# Altium project bogo_board.PrjPcb (part 1 of 4)
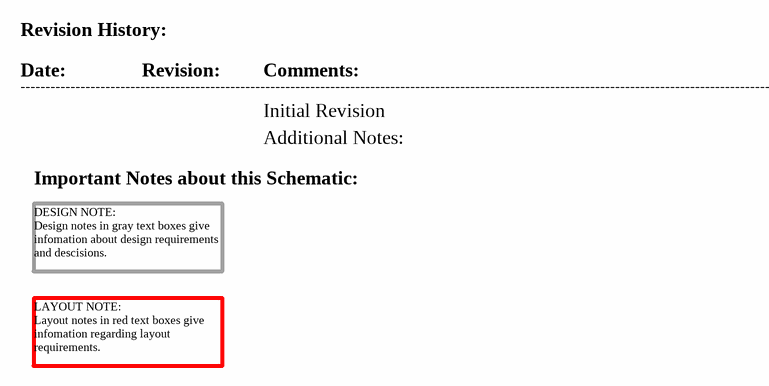
[diagram p0: 01-Revision_History_and_Contents.SchDoc]
10 sheets, 195 parts. Net scope: global (net labels, ports and power ports of the same name join across sheets).
Board file: bogo_board.PcbDoc
Sheets:
  01-Revision_History_and_Contents.SchDoc
  05_Buzz_Pump_LED_Temp_ICs.SchDoc
  04_Brushed_Motor_ICs.SchDoc
  03_Power_ICs.SchDoc
  10_Mechanical.SchDoc
  02_Connectors.SchDoc
  07_MCU.SchDoc
  08_Programming_Reset.SchDoc
  06_Servo_Motor_ICs.SchDoc
  09_USB_Bridge.SchDoc

## Sheet 01-Revision_History_and_Contents.SchDoc: Revision History and Table of Contents
size A; Revision: A; SheetNumber: 1; SheetTotal: 10; ECE315_Project_Name: ECE453 F23 Base Project

### Notes on the sheet
- Revision History:
- Date:
- ----------------------------------------------------------------------------------------------------------------------------------------------------------------------
- Revision:
- Comments:
- Initial Revision
- Important Notes about this Schematic:
- Additional Notes:
- DESIGN NOTE:
  Design notes in gray text boxes give infomation about design requirements and descisions.
- LAYOUT NOTE:
  Layout notes in red text boxes give infomation regarding layout requirements.
- Title:
- Size:
- A
- Project
- Rev:
- Sheet:
- of
- College of Engineering
- 1415 Engineering Drive
- Madison, WI 53706

## Sheet 05_Buzz_Pump_LED_Temp_ICs.SchDoc: Buzz Pump LED Temp ICs
size A; Revision: A; SheetNumber: 5; SheetTotal: 10; ECE315_Project_Name: ECE453 F23 Base Project
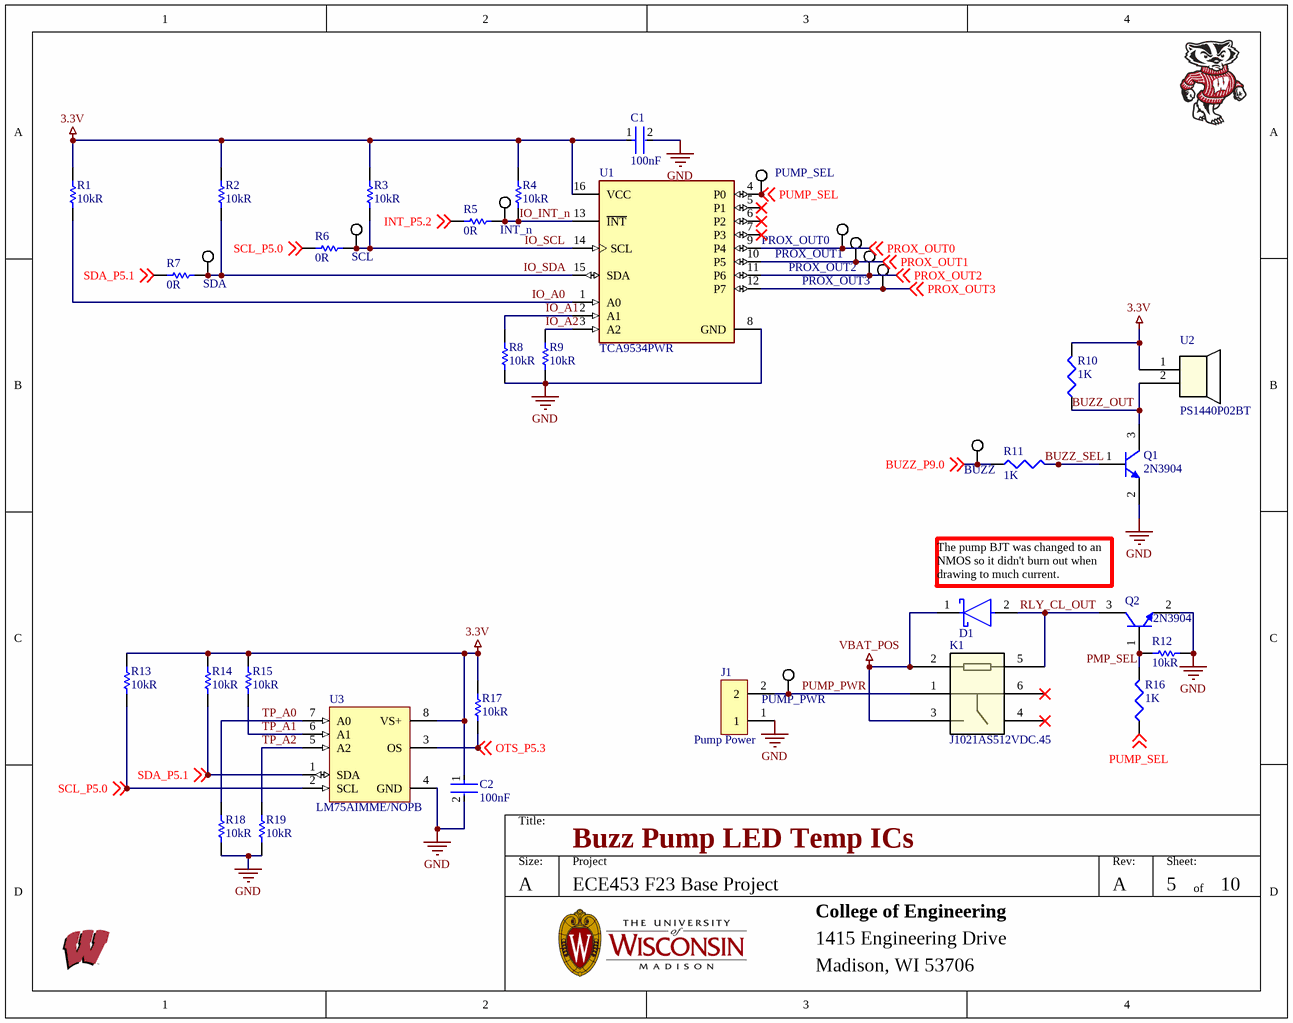
[diagram p1: 05_Buzz_Pump_LED_Temp_ICs.SchDoc]

### Parts
BUZZ  5019  [KSTN-5019_V]  (value not drawn)
C1  value 100nF  [FP-C0805C-DN-MFG]  (hidden comment: C0805C104K5RACTU)
C2  value 100nF  [FP-C0805C-DN-MFG]  (hidden comment: C0805C104K5RACTU)
D1  SM5817PL-TP  [On_Semiconductor_425-04_IPC_A]  (value not drawn)
INT_n  5019  [KSTN-5019_V]  (value not drawn)
J1  Pump Power  [PHOENIX2X0.2]
K1  J1021AS512VDC.45  [RELAY6_J102_CRS]
PROX_OUT0  5019  [KSTN-5019_V]  (value not drawn)
PROX_OUT1  5019  [KSTN-5019_V]  (value not drawn)
PROX_OUT2  5019  [KSTN-5019_V]  (value not drawn)
PROX_OUT3  5019  [KSTN-5019_V]  (value not drawn)
PUMP_PWR  5019  [KSTN-5019_V]  (value not drawn)
PUMP_SEL  5019  [KSTN-5019_V]  (value not drawn)
Q1  2N3904  [SOT-23_M]
Q2  2N3904  [SOT-23_M]
R1  Resistance: 10kR  [RESC2013X60X35NL10T20]  (hidden comment: RC0805FR-0710KL)
R2  Resistance: 10kR  [RESC2013X60X35NL10T20]  (hidden comment: RC0805FR-0710KL)
R3  Resistance: 10kR  [RESC2013X60X35NL10T20]  (hidden comment: RC0805FR-0710KL)
R4  Resistance: 10kR  [RESC2013X60X35NL10T20]  (hidden comment: RC0805FR-0710KL)
R5  value 0R  [RESC2013X70X40NL20T20]  (hidden comment: ERJ-6GEY0R00V)
R6  value 0R  [RESC2013X70X40NL20T20]  (hidden comment: ERJ-6GEY0R00V)
R7  value 0R  [RESC2013X70X40NL20T20]  (hidden comment: ERJ-6GEY0R00V)
R8  Resistance: 10kR  [RESC2013X60X35NL10T20]  (hidden comment: RC0805FR-0710KL)
R9  Resistance: 10kR  [RESC2013X60X35NL10T20]  (hidden comment: RC0805FR-0710KL)
R10  value 1K  [RES_0805]  (hidden comment: 10K)
R11  value 1K  [RES_0805]  (hidden comment: 10K)
R12  Resistance: 10kR  [RESC2013X60X35NL10T20]  (hidden comment: RC0805FR-0710KL)
R13  Resistance: 10kR  [RESC2013X60X35NL10T20]  (hidden comment: RC0805FR-0710KL)
R14  Resistance: 10kR  [RESC2013X60X35NL10T20]  (hidden comment: RC0805FR-0710KL)
R15  Resistance: 10kR  [RESC2013X60X35NL10T20]  (hidden comment: RC0805FR-0710KL)
R16  value 1K  [RES_0805]  (hidden comment: 10K)
R17  Resistance: 10kR  [RESC2013X60X35NL10T20]  (hidden comment: RC0805FR-0710KL)
R18  Resistance: 10kR  [RESC2013X60X35NL10T20]  (hidden comment: RC0805FR-0710KL)
R19  Resistance: 10kR  [RESC2013X60X35NL10T20]  (hidden comment: RC0805FR-0710KL)
SCL  5019  [KSTN-5019_V]  (value not drawn)
SDA  5019  [KSTN-5019_V]  (value not drawn)
U1  TCA9534PWR  [FP-PW0016A-IPC_C]
U2  PS1440P02BT  [PS1440P02BT_TDK]
U3  LM75AIMME/NOPB  [DGK0008A_L]

### Nets
3.3V: C1.1 C2.1 R1.2 R2.2 R3.2 R4.2 R10.2 R13.2 R14.2 R15.2 R17.2 U1.16(VCC) U2.1 U3.8(VS+)
GND: C1.2 C2.2 J1.1 Q1.2(E) Q2.2(E) R8.1 R9.1 R12.1 R18.1 R19.1 U1.8(GND) U3.4(GND)
VBAT_POS: D1.1(C) K1.2 K1.3
BUZZ_OUT: Q1.3(C) R10.1 U2.2
BUZZ_P9.0: BUZZ.1 R11.1 ; off-sheet BUZZ_P9.0
BUZZ_SEL: Q1.1(B) R11.2
INT_P5.2: R5.1 ; off-sheet INT_P5.2
IO_A0: R1.1 U1.1(A0)
IO_A1: R8.2 U1.2(A1)
IO_A2: R9.2 U1.3(A2)
IO_INT_n: INT_n.1 R4.1 R5.2 U1.13(~{INT})
IO_SCL: R3.1 R6.2 SCL.1 U1.14(SCL)
IO_SDA: R2.1 R7.2 SDA.1 U1.15(SDA)
OTS_P5.3: R17.1 U3.3(OS) ; off-sheet OTS_P5.3
PMP_SEL: Q2.1(B) R12.2 R16.2
PROX_OUT0: PROX_OUT0.1 U1.9(P4) ; off-sheet PROX_OUT0
PROX_OUT1: PROX_OUT1.1 U1.10(P5) ; off-sheet PROX_OUT1
PROX_OUT2: PROX_OUT2.1 U1.11(P6) ; off-sheet PROX_OUT2
PROX_OUT3: PROX_OUT3.1 U1.12(P7) ; off-sheet PROX_OUT3
PUMP_PWR: J1.2 K1.1 PUMP_PWR.1
PUMP_SEL: PUMP_SEL.1 R16.1 U1.4(P0) ; off-sheet PUMP_SEL
RLY_CL_OUT: D1.2(A) K1.5 Q2.3(C)
SCL_P5.0: R6.1 R13.1 U3.2(SCL) ; off-sheet SCL_P5.0
SDA_P5.1: R7.1 R14.1 U3.1(SDA) ; off-sheet SDA_P5.1
TP_A0: R18.2 U3.7(A0)
TP_A1: R15.1 U3.6(A1)
TP_A2: R19.2 U3.5(A2)

Not connected (* = marked no-connect by the designer): K1 4* 6*; U1 5(P1)* 6(P2)* 7(P3)*

### Notes on the sheet
- The pump BJT was changed to an NMOS so it didn't burn out when drawing to much current.
- Title:
- Size:
- A
- Project
- Rev:
- Sheet:
- of
- College of Engineering
- 1415 Engineering Drive
- Madison, WI 53706

### Library data of the parts
BUZZ INT_n PROX_OUT0-PROX_OUT3 PUMP_PWR PUMP_SEL SCL SDA = CMP-1672-00008-1: Test Point, 1 Position SMD, RoHS, Tape and Reel; Manufacturer: Keystone Electronics; Plating: Silver; Body Material: Bronze; Supplier: Newark; Supplier Part Number: 59Y8500; Manufacturer Part Number: 5019; RoHS: Yes; Category: Connectors; Stock: 11269; Pricing: 1=0.411, 10=0.389, 25=0.285, 50=0.279, 100=0.273, 250=0.246 (USD); Mounting Technology: Surface Mount,PCB; Pins: 1; Contact Plating: Silver; Contact Material: Bronze; Material: Bronze; Packaging: Tape and Reel; Package Quantity: 1; Termination: SMD/SMT; Series: 5019; Height: 0.09inch; Reach SVHC Compliant: No; RoHS Compliant: Yes; Lead Free: Lead Free; ComponentLink1URL: https://datasheet.ciiva.com/14848/m60-2p61-14848437.pdf?src-supplier=Digi-Key; ComponentLink1Description: https://datasheet.ciiva.com/14848/m60-2p61-14848437.pdf?src-supplier=Digi-Key; ComponentLink2URL: https://datasheet.ciiva.com/14848/m60-2p61-14848438.pdf?src-supplier=Digi-Key; ComponentLink2Description: https://datasheet.ciiva.com/14848/m60-2p61-14848438.pdf?src-supplier=Digi-Key; ComponentLink3URL: https://datasheet.ciiva.com/14848/m60-2p61-14848439.pdf?src-supplier=Digi-Key; ComponentLink3Description: https://datasheet.ciiva.com/14848/m60-2p61-14848439.pdf?src-supplier=Digi-Key; ComponentLink4URL: https://datasheet.ciiva.com/16318/m60-2p61-16318395.pdf?src-supplier=Future+Electronics; ComponentLink4Description: https://datasheet.ciiva.com/16318/m60-2p61-16318395.pdf?src-supplier=Future+Electronics; ComponentLink5URL: https://datasheet.ciiva.com/16885/70182998-16885945.pdf?src-supplier=Allied+Electronics; ComponentLink5Description: https://datasheet.ciiva.com/16885/70182998-16885945.pdf?src-supplier=Allied+Electronics
C1 C2 = CMP-2007-00279-2: CAP CER 0.1UF 50V X7R 0805; Manufacturer: KEMET; Tolerance: 10%; Voltage: 500V; ComponentLink2Description: Datasheet; ComponentLink2URL: https://content.kemet.com/datasheets/KEM_C1003_C0G_SMD.pdf; Supplier: Newark; Supplier Part Number: 19C6015; Manufacturer Part Number: C0805C104K5RACTU; RoHS: Yes; Category: Ceramic Capacitors; Stock: 3382390; Pricing: 1=0.024, 25=0.024, 50=0.024, 100=0.024, 250=0.024, 500=0.024, 1000=0.024 (USD); Mounting Technology: Surface Mount,PCB; Case/Package: 0805; Pins: 2; Case Code (Imperial): 0805; Case Code (Metric): 2012; Min Operating Temperature: -55°C; Max Operating Temperature: 125°C; Package Quantity: 4000; Voltage Rating: 50V; Packaging: Tape and Reel; Voltage Rating (DC): 50V; Dielectric: X7R; Termination: SMD/SMT; Series: SMD Comm X7R; Construction: Flat; Length: 2mm; Width: 1.2mm; Height: 0.9mm; Lead Pitch: 0.75mm; Depth: 1.25mm; Radiation Hardening: No; RoHS Compliant: Yes; Reach SVHC Compliant: No; ComponentLink1URL: https://datasheet.ciiva.com/32431/slceramic-chip-condensers-e-32431755.pdf?src-supplier=Distrelec; ComponentLink1Description: https://datasheet.ciiva.com/32431/slceramic-chip-condensers-e-32431755.pdf?src-supplier=Distrelec; ComponentLink3URL: https://datasheet.ciiva.com/28682/1851736-28682232.pdf?src-supplier=Element14; ComponentLink3Description: https://datasheet.ciiva.com/28682/1851736-28682232.pdf?src-supplier=Element14
D1 = SM5817PL-TP: DIODE SCHOTTKY 20V 1A SOD123FL; Forward Voltage: 450mV; Max Surge Current: 30A; Element Configuration: Single; Manufacturer 2: MCC; Manufacturer Part Number 2: SM5817PL-TP; RoHS: Yes; Category: Rectifier Diodes; Stock 2: 178040; Pricing 2: 1=0.46000, 10=0.31900, 100=0.16110, 500=0.13144, 1000=0.09752 (USD); Mount: Surface Mount; Number of Pins: 2; Min Operating Temperature: -65°C; Max Operating Temperature: 125°C; Packaging: Tape and Reel; Package Quantity: 1; Average Rectified Current: 1A; Peak Non-Repetitive Surge Current: 30A; Max Reverse Voltage (DC): 20V; Reverse Voltage: 20V; Radiation Hardening: No; RoHS Compliant: Yes; ComponentLink1URL: https://datasheet.ciiva.com/15200/getdatasheetpartid-487494-15200581.pdf?src-supplier=Verical; ComponentLink1Description: https://datasheet.ciiva.com/15200/getdatasheetpartid-487494-15200581.pdf?src-supplier=Verical; ComponentLink2URL: https://datasheet.ciiva.com/912/sm5817pl-sm5819plsod-123fl-912827.pdf?src-supplier=Digi-Key; ComponentLink2Description: https://datasheet.ciiva.com/912/sm5817pl-sm5819plsod-123fl-912827.pdf?src-supplier=Digi-Key; Supplier 1: Digi-Key; Supplier Part Number 1: SM5817PL-TPMSCT-ND
J1 = 2-Pin: 2~24 Poles, Screw Type, Horizontal, 5.08 Pitch, 26~14 (AWG), Terminal Block Connector; Manufacturer: CUI Devices; Manufacturer Part Number: TB006-508-02BE; ComponentLink1URL: https://datasheet.ciiva.com/709/eng-cd-640456-w1-709680.pdf?src-supplier=Digi-Key; ComponentLink1Description: https://datasheet.ciiva.com/709/eng-cd-640456-w1-709680.pdf?src-supplier=Digi-Key; ComponentLink2URL: https://datasheet.ciiva.com/3118/eng-ds-82056-mta-0608-3118497.pdf?src-supplier=Avnet; ComponentLink2Description: https://datasheet.ciiva.com/3118/eng-ds-82056-mta-0608-3118497.pdf?src-supplier=Avnet; ComponentLink3URL: https://datasheet.ciiva.com/16401/eng-ds-82056-mta-0608-16401289.pdf?src-supplier=Future+Electronics; ComponentLink3Description: https://datasheet.ciiva.com/16401/eng-ds-82056-mta-0608-16401289.pdf?src-supplier=Future+Electronics; ComponentLink4URL: https://datasheet.ciiva.com/25617/0900766b80027008-25617244.pdf?src-supplier=RSComponents; ComponentLink4Description: https://datasheet.ciiva.com/25617/0900766b80027008-25617244.pdf?src-supplier=RSComponents; ComponentLink5URL: https://datasheet.ciiva.com/14156/04384301-14156820.pdf?src-supplier=Distrelec; ComponentLink5Description: https://datasheet.ciiva.com/14156/04384301-14156820.pdf?src-supplier=Distrelec; ComponentLink6URL: https://datasheet.ciiva.com/11746/0900766b80eb7fdd-11746365.pdf?src-supplier=RSComponents; ComponentLink6Description: https://datasheet.ciiva.com/11746/0900766b80eb7fdd-11746365.pdf?src-supplier=RSComponents; ComponentLink7URL: https://datasheet.ciiva.com/7128/1866390-7128742.pdf?src-supplier=Newark; ComponentLink7Description: https://datasheet.ciiva.com/7128/1866390-7128742.pdf?src-supplier=Newark; ComponentLink8URL: https://datasheet.ciiva.com/16505/eng-ds-82056-mta-0608-16505419.pdf?src-supplier=Avnet+Asia; ComponentLink8Description: https://datasheet.ciiva.com/16505/eng-ds-82056-mta-0608-16505419.pdf?src-supplier=Avnet+Asia; Supplier: Digi-Key; RoHS: Yes; Category: Terminal Blocks; Stock 1: 50889; Pricing 1: 1=0.86, 10=0.472, 25=0.3524, 50=0.3142, 100=0.308, 250=0.27108, 500=0.24644, 1000=0.2218, 5000=0.16635 (USD); Supplier Part Number: 102-6191-ND
K1 = J1021AS512VDC.45: No Description Available; Mfr_Name: CIT Relay & Switch; Type: DEV; Copyright: Copyright (C) 2023 Ultra Librarian. All rights reserved.; Manufacturer_Part_Number: J1021AS512VDC.45; RefDes: RefDes
Q1 Q2 = 2N3904: NPN General Purpose Amplifier; Manufacturer Part Number: MMBT3904-7-F; Manufacturer: Diodes Incorporated; Frequency - Transition: 300MHz; Power - Max: 300mW; DC Current Gain (hFE) (Min) @ Ic, Vce: 100 @ 10mA, 1V; Current - Collector Cutoff (Max): 50nA (ICBO); Vce Saturation (Max) @ Ib, Ic: 300mV @ 5mA, 50mA; Voltage - Collector Emitter Breakdown (Max): 40V; Current - Collector (Ic) (Max): 200mA; Supplier Device Package: SOT-23-3; Mounting Type: Surface Mount; Transistor Type: NPN; Packaging: Cut Tape (CT); RoHS: RoHS Compliant; Package / Case: TO-236-3, SC-59, SOT-23-3; Supplier Part Number: MMBT3904-FDICT-ND; Supplier: Digi-Key; Category: Discrete Semiconductor Products; Value: 2N3904
R1-R4 R8 R9 R12-R15 R17-R19 = CMP-1659-00013-4: Chip Resistor, 10 KOhm, +/- 1%, 0.125 W, -55 to 155 degC, 0805 (2012 Metric), RoHS, Tape and Reel; Manufacturer: Yageo; Voltage Rating: 150 V; Temperature Coefficient: 100ppm/°C; Power Rating: 125mW; Value: 10kR; Mount: Surface Mount; ComponentLink1Description: Manufacturer URL; ComponentLink2URL: http://www.yageo.com/documents/recent/PYu-RC_Group_51_RoHS_L_04.pdf; Pins: 2; Length: 2 mm; Min Operating Temperature: -55 degC; Height: 0.5 mm; Mounting Technology: Surface Mount; RoHSCompliant: true; REACH SVHC: No SVHC; ComponentLink1URL: http://www.yageo.com/; Max Operating Temperature: 155 degC; PackageReference: 0805; DatasheetVersion: Rev. 4, 02/2016; Package Quantity: 5000; Packaging: Tape and Reel; ComponentLink2Description: Datasheet; PackageDescription: 2-Pin Surface Mounted Device, Body 2 x 1.25 mm; Supplier 1: Digi-Key; Supplier Part Number 1: 311-10.0KCRCT-ND; Manufacturer 1: Yageo; Manufacturer Part Number 1: RC0805FR-0710KL; RoHS: Yes; Category: Chip SMD Resistors; Stock 1: 5682818; Pricing 1: 1=0.10000, 10=0.03800, 100=0.01560, 1000=0.00702, 2500=0.00610 (USD); Case/Package: 0805; Case Code (Imperial): 0805; Case Code (Metric): 2012; Size Code: 0805; Tolerance: 1%; Resistor Type: Thick Film; Series: RC; Number of Terminations: 2; Max Power Dissipation: 125mW; Termination: SMD/SMT; Features: Moisture Resistant; Construction: Rectangular; Resistance Tolerance: 1%; Technology: THICK FILM; Width: 0.049inch; Depth: 1.25mm; RoHS Compliant: Yes; Military Standard: Not; Lead Free: Lead Free; ComponentLink3URL: https://datasheet.ciiva.com/11808/0900766b8106beab-11808151.pdf?src-supplier=RSComponents; ComponentLink3Description: https://datasheet.ciiva.com/11808/0900766b8106beab-11808151.pdf?src-supplier=RSComponents; ComponentLink4URL: https://datasheet.ciiva.com/46447/444164-46447563.pdf?src-supplier=Element14; ComponentLink4Description: https://datasheet.ciiva.com/46447/444164-46447563.pdf?src-supplier=Element14; ComponentLink5URL: https://datasheet.ciiva.com/2456/pyu-r-int-thick-7-2456973.pdf?src-supplier=Digi-Key; ComponentLink5Description: https://datasheet.ciiva.com/2456/pyu-r-int-thick-7-2456973.pdf?src-supplier=Digi-Key; ComponentLink6URL: https://datasheet.ciiva.com/2456/pyu-r-int-thick-7-2456974.pdf?src-supplier=Digi-Key; ComponentLink6Description: https://datasheet.ciiva.com/2456/pyu-r-int-thick-7-2456974.pdf?src-supplier=Digi-Key; ComponentLink7URL: https://datasheet.ciiva.com/2456/pyu-r-int-thick-7-2456972.pdf?src-supplier=Digi-Key; ComponentLink7Description: https://datasheet.ciiva.com/2456/pyu-r-int-thick-7-2456972.pdf?src-supplier=Digi-Key; ComponentLink8URL: https://datasheet.ciiva.com/12669/rc0805-12669688.pdf?src-supplier=Mouser; ComponentLink8Description: https://datasheet.ciiva.com/12669/rc0805-12669688.pdf?src-supplier=Mouser; ComponentLink9URL: https://datasheet.ciiva.com/16747/rc0805-16747087.pdf?src-supplier=Future+Electronics; ComponentLink9Description: https://datasheet.ciiva.com/16747/rc0805-16747087.pdf?src-supplier=Future+Electronics; Supplier: Newark; Supplier Part Number: 05M4535; Manufacturer Part Number: RC0805FR-0710KL; Stock: 346650; Pricing: 1=0.102, 10=0.035, 25=0.028, 50=0.021, 100=0.014 (USD); Reach SVHC Compliant: Unknown; ComponentLink10URL: https://datasheet.ciiva.com/11808/0900766b8106beab-11808151.pdf?src-supplier=Rs; ComponentLink10Description: https://datasheet.ciiva.com/11808/0900766b8106beab-11808151.pdf?src-supplier=Rs
R5-R7 = CMP-1665-00002-5: Chip Resistor, 0 Ohm, +/- 1%, 0.125 W, -55 to 155 degC, 0805 (2012 Metric), RoHS, Tape and Reel; Manufacturer: Panasonic; Tolerance: 5%; Resistance: 0 Ohm; Power Rating: 125mW; Temperature Coefficient: 600ppm/°C; Voltage Rating: 150V; Current Rating: 2A; REACH SVHC: No SVHC; Min Operating Temperature: -55 degC; Case/Package: 0805; Packaging: Tape and Reel; Package Quantity: 5000; ComponentLink1Description: Manufacturer URL; PackageDescription: 2-Pin Surface Mount Device, Body 2 x 1.25 mm; Mounting Technology: Surface Mount; Max Operating Temperature: 155 degC; PartNumber: ERJ-6GEY0R00V; Width: 1.25 mm; RoHSCompliant: True; Height: 0.6 mm; ComponentLink1URL: http://www.panasonic.com/; ComponentLink2URL: http://industrial.panasonic.com/cdbs/www-data/pdf/RDA0000/AOA0000C84.pdf; Case Code (Imperial): 0805; DatasheetVersion: 03/2015; Length: 2 mm; Case Code (Metric): 2012; ComponentLink2Description: Datasheet; Radiation Hardening: No; Supplier: Newark; Supplier Part Number: 65T8846; Manufacturer Part Number: ERJ-6GEY0R00V; RoHS: Yes; Category: Chip SMD Resistors; Stock: 200593; Pricing: 1=0.008, 25=0.008, 50=0.008, 100=0.008, 250=0.008, 500=0.008, 1000=0.008 (USD); Contact Plating: Tin; Series: ERJ; Termination: SMD/SMT; Resistor Type: Thick Film; Number of Terminations: 2; Technology: THICK FILM; Construction: Rectangular; Max Power Dissipation: 125mW; Voltage Rating (DC): 150V; Features: Automotive AEC-Q200; Depth: 1.25mm; Ratings: AEC-Q200; RoHS Compliant: Yes; Reach SVHC Compliant: No; Military Standard: Not; Lead Free: Lead Free
R10 R11 R16 = Res3_1: Res Thick Film 0805 1K Ohm 1% 0.125W(1/8W) ±100ppm/C Pad SMD Automotive T/R; Manufacturer: Stackpole Electronics; Manufacturer Part Number: RMCF0805FT1K00; Power Rating: 125mW; Temperature Coefficient: 100ppm/°C; Supplier 1: Digi-Key; Supplier Part Number 1: RMCF0805FT1K00CT-ND; RoHS: Yes; Category: Chip SMD Resistors; Stock 1: 2773085; Pricing 1: 1=0.10000, 10=0.02400, 100=0.00970, 1000=0.00437, 2500=0.00379 (USD); Mounting Technology: Surface Mount; Case/Package: 0805; Case Code (Metric): 2012; Case Code (Imperial): 0805; Contact Plating: Tin,Matte; Min Operating Temperature: -55°C; Max Operating Temperature: 155°C; Tolerance: 1%; Packaging: Tape and Reel; Resistor Type: Thick Film; Number of Terminations: 2; Max Power Dissipation: 125mW; Features: Automotive AEC-Q200; Series: RMCF; Construction: Rectangular; Length: 2mm; Width: 0.049inch; Height: 0.026inch; Depth: 1.25mm; Radiation Hardening: No; Military Standard: Not; Lead Free: Lead Free; RoHS Compliant: Yes; ComponentLink1URL: https://datasheet.ciiva.com/15193/getdatasheetpartid-360136-15193546.pdf?src-supplier=Verical; ComponentLink1Description: https://datasheet.ciiva.com/15193/getdatasheetpartid-360136-15193546.pdf?src-supplier=Verical
U1 = CMP-04886-000003-2: IC I/O EXPANDER I2C 8B 16TSSOP; Manufacturer 1: Texas Instruments; Number of I/Os: 8; Frequency: 400kHz; Packaging: Tape and Reel; Number of Pins: 16; Min Operating Temperature: -40°C; RoHS Compliant: Yes; Number of Outputs: 8; Lead Free: Lead Free; Mount: Surface Mount; Max Operating Temperature: 85°C; Interface: I2C; Case/Package: TSSOP; Supplier 1: Digi-Key; Supplier Part Number 1: 296-40574-1-ND; Manufacturer Part Number 1: TCA9534PWR; RoHS: Yes; Category: Interface ICs; Stock 1: 63981; Pricing 1: 1=1.45000, 10=1.29500, 25=1.22880, 100=1.00930, 250=0.94352, 500=0.83380, 1000=0.66240 (USD); ComponentLink1URL: https://datasheet.ciiva.com/48508/tca9534-48508117.pdf?src-supplier=Avnet; ComponentLink1Description: https://datasheet.ciiva.com/48508/tca9534-48508117.pdf?src-supplier=Avnet
U2 = PS1440P02BT: No Description Available; Mfr_Name: TDK; Copyright: Copyright (C) 2023 Ultra Librarian. All rights reserved.; Manufacturer_Part_Number: PS1440P02BT; RefDes: RefDes; Type: DEV
U3 = CMP-0066-00292-3: Digital Temperature Sensor and Thermal Watchdog with Two-Wire Interface, 8-pin Mini SOIC, Pb-Free; Manufacturer: Texas Instruments; CompType: Temp Sensor IC; PackageTopMarking: ZXTT*T00A; PowerWise: N; ComponentLink1Description: Datasheet URL; PackageDescription: MINI SOIC, .118 x .118 x .034in, 8 Lead, .0256in Pitch; PinCount: 8; ComponentLink1URL: http://www.ti.com/general/docs/lit/getliterature.tsp?genericPartNumber=LM75A&fileType=pdf; PackageReference: DGK0008A; Code_JEDEC: MO-187-AA; RoHS: Y

## Sheet 04_Brushed_Motor_ICs.SchDoc: Brushed Motor ICs
size A; Revision: A; SheetNumber: 4; SheetTotal: 10; ECE315_Project_Name: ECE453 F23 Base Project
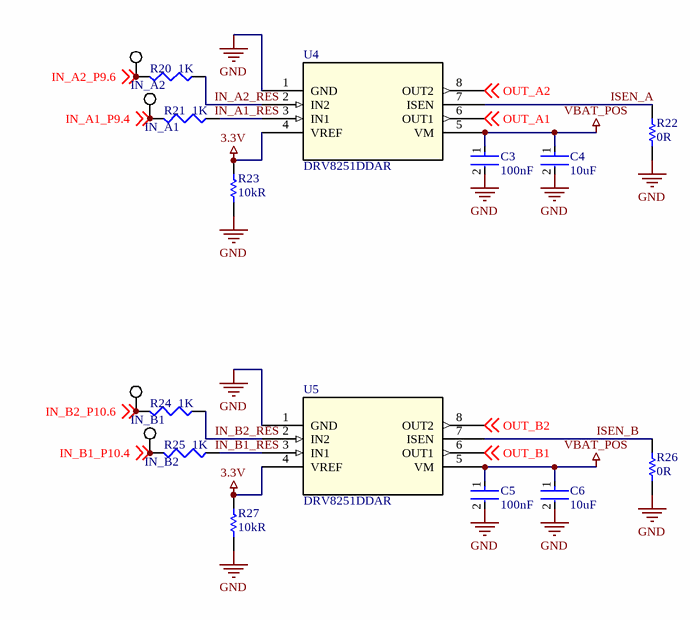
[diagram p2: 04_Brushed_Motor_ICs.SchDoc]

### Parts
C3  value 100nF  [CAP_0805]  (hidden comment: C0805C104K5RACTU)
C4  value 10uF  [CAP_0805]  (hidden comment: C0805C106K8PACTU)
C5  value 100nF  [CAP_0805]  (hidden comment: C0805C104K5RACTU)
C6  value 10uF  [CAP_0805]  (hidden comment: C0805C106K8PACTU)
IN_A1  5019  [KSTN-5019_V]  (value not drawn)
IN_A2  5019  [KSTN-5019_V]  (value not drawn)
IN_B1  5019  [KSTN-5019_V]  (value not drawn)
IN_B2  5019  [KSTN-5019_V]  (value not drawn)
R20  value 1K  [RESC2013X70X40ML20T20]  (hidden comment: 10K)
R21  value 1K  [RESC2013X70X40ML20T20]  (hidden comment: 10K)
R22  value 0R  [RESC2013X70X40NL20T20]  (hidden comment: ERJ-6GEY0R00V)
R23  Resistance: 10kR  [RESC2013X60X35NL10T20]  (hidden comment: RC0805FR-0710KL)
R24  value 1K  [RESC2013X70X40ML20T20]  (hidden comment: 10K)
R25  value 1K  [RESC2013X70X40ML20T20]  (hidden comment: 10K)
R26  value 0R  [RESC2013X70X40NL20T20]  (hidden comment: ERJ-6GEY0R00V)
R27  Resistance: 10kR  [RESC2013X60X35NL10T20]  (hidden comment: RC0805FR-0710KL)
U4  DRV8251DDAR  [POWERPAD_DDA_TEX-M]
U5  DRV8251DDAR  [POWERPAD_DDA_TEX-M]

### Nets
3.3V: R23.2 R27.2 U4.4(VREF) U5.4(VREF)
GND: C3.2 C4.2 C5.2 C6.2 R22.1 R23.1 R26.1 R27.1 U4.1(GND) U5.1(GND)
VBAT_POS: C3.1 C4.1 C5.1 C6.1 U4.5(VM) U5.5(VM)
IN_A1_P9.4: IN_A1.1 R21.2 ; off-sheet IN_A1_P9.4
IN_A1_RES: R21.1 U4.3(IN1)
IN_A2_P9.6: IN_A2.1 R20.2 ; off-sheet IN_A2_P9.6
IN_A2_RES: R20.1 U4.2(IN2)
IN_B1_P10.4: IN_B2.1 R25.2 ; off-sheet IN_B1_P10.4
IN_B1_RES: R25.1 U5.3(IN1)
IN_B2_P10.6: IN_B1.1 R24.2 ; off-sheet IN_B2_P10.6
IN_B2_RES: R24.1 U5.2(IN2)
ISEN_A: R22.2 U4.7(ISEN)
ISEN_B: R26.2 U5.7(ISEN)
OUT_A1: U4.6(OUT1) ; off-sheet OUT_A1
OUT_A2: U4.8(OUT2) ; off-sheet OUT_A2
OUT_B1: U5.6(OUT1) ; off-sheet OUT_B1
OUT_B2: U5.8(OUT2) ; off-sheet OUT_B2

### Notes on the sheet
- Title:
- Size:
- A
- Project
- Rev:
- Sheet:
- of
- College of Engineering
- 1415 Engineering Drive
- Madison, WI 53706

### Library data of the parts
C3 C5 = CMP-2007-00279-2: as C1 on sheet 05_Buzz_Pump_LED_Temp_ICs; ComponentLink2Description: Datasheet; ComponentLink2URL: https://content.kemet.com/datasheets/KEM_C1003_C0G_SMD.pdf; Supplier: Newark; Supplier Part Number: 19C6015; Manufacturer Part Number: C0805C104K5RACTU; RoHS: Yes; Category: Ceramic Capacitors; Stock: 3382390; Pricing: 1=0.024, 25=0.024, 50=0.024, 100=0.024, 250=0.024, 500=0.024, 1000=0.024 (USD); Mounting Technology: Surface Mount,PCB; Case/Package: 0805; Pins: 2; Case Code (Imperial): 0805; Case Code (Metric): 2012; Min Operating Temperature: -55°C; Max Operating Temperature: 125°C; Package Quantity: 4000; Voltage Rating: 50V; Packaging: Tape and Reel; Voltage Rating (DC): 50V; Dielectric: X7R; Termination: SMD/SMT; Series: SMD Comm X7R; Construction: Flat; Length: 2mm; Width: 1.2mm; Height: 0.9mm; Lead Pitch: 0.75mm; Depth: 1.25mm; Radiation Hardening: No; RoHS Compliant: Yes; Reach SVHC Compliant: No; ComponentLink1URL: https://datasheet.ciiva.com/32431/slceramic-chip-condensers-e-32431755.pdf?src-supplier=Distrelec; ComponentLink1Description: https://datasheet.ciiva.com/32431/slceramic-chip-condensers-e-32431755.pdf?src-supplier=Distrelec; ComponentLink3URL: https://datasheet.ciiva.com/28682/1851736-28682232.pdf?src-supplier=Element14; ComponentLink3Description: https://datasheet.ciiva.com/28682/1851736-28682232.pdf?src-supplier=Element14
C4 C6 = CMP-2007-03243-2: CAP CER 10UF 10V X5R 0805; Manufacturer: KEMET; Dielectric Material: Ceramic; Tolerance: 10%; Supplier: Newark; Supplier Part Number: 70K9138; Manufacturer Part Number: C0805C106K8PACTU; RoHS: Yes; Category: Ceramic Capacitors; Stock: 186414; Pricing: 1=0.141, 25=0.141, 50=0.141, 100=0.141, 250=0.141, 500=0.141, 1000=0.141 (USD); Mounting Technology: Surface Mount; Case/Package: 0805; Pins: 2; Contact Plating: Tin,Matte; Case Code (Imperial): 0805; Case Code (Metric): 2012; Min Operating Temperature: -55°C; Max Operating Temperature: 85°C; Packaging: Tape and Reel; Dielectric: X5R; Voltage Rating (DC): 10V; Termination: SMD/SMT; Package Quantity: 1; Voltage Rating: 10V; Voltage: 10V; Dissipation Factor: 10%; Series: C; Construction: Flat; Length: 2mm; Width: 0.049inch; Height: 1.25mm; Depth: 1.25mm; Thickness: 0.055inch; Radiation Hardening: No; Reach SVHC Compliant: No; RoHS Compliant: Yes; ComponentLink1URL: https://datasheet.ciiva.com/7842/1732709-7842198.pdf?src-supplier=Element14; ComponentLink1Description: https://datasheet.ciiva.com/7842/1732709-7842198.pdf?src-supplier=Element14
IN_A1 IN_A2 IN_B1 IN_B2 = CMP-1672-00008-1: as BUZZ on sheet 05_Buzz_Pump_LED_Temp_ICs; Supplier: Newark; Supplier Part Number: 59Y8500; Manufacturer Part Number: 5019; RoHS: Yes; Category: Connectors; Stock: 11269; Pricing: 1=0.411, 10=0.389, 25=0.285, 50=0.279, 100=0.273, 250=0.246 (USD); Mounting Technology: Surface Mount,PCB; Pins: 1; Contact Plating: Silver; Contact Material: Bronze; Material: Bronze; Packaging: Tape and Reel; Package Quantity: 1; Termination: SMD/SMT; Series: 5019; Height: 0.09inch; Reach SVHC Compliant: No; RoHS Compliant: Yes; Lead Free: Lead Free; ComponentLink1URL: https://datasheet.ciiva.com/14848/m60-2p61-14848437.pdf?src-supplier=Digi-Key; ComponentLink1Description: https://datasheet.ciiva.com/14848/m60-2p61-14848437.pdf?src-supplier=Digi-Key; ComponentLink2URL: https://datasheet.ciiva.com/14848/m60-2p61-14848438.pdf?src-supplier=Digi-Key; ComponentLink2Description: https://datasheet.ciiva.com/14848/m60-2p61-14848438.pdf?src-supplier=Digi-Key; ComponentLink3URL: https://datasheet.ciiva.com/14848/m60-2p61-14848439.pdf?src-supplier=Digi-Key; ComponentLink3Description: https://datasheet.ciiva.com/14848/m60-2p61-14848439.pdf?src-supplier=Digi-Key; ComponentLink4URL: https://datasheet.ciiva.com/16318/m60-2p61-16318395.pdf?src-supplier=Future+Electronics; ComponentLink4Description: https://datasheet.ciiva.com/16318/m60-2p61-16318395.pdf?src-supplier=Future+Electronics; ComponentLink5URL: https://datasheet.ciiva.com/16885/70182998-16885945.pdf?src-supplier=Allied+Electronics; ComponentLink5Description: https://datasheet.ciiva.com/16885/70182998-16885945.pdf?src-supplier=Allied+Electronics
R20 R21 R24 R25 = Res3_1: as R10 on sheet 05_Buzz_Pump_LED_Temp_ICs; Supplier 1: Digi-Key; Supplier Part Number 1: RMCF0805FT1K00CT-ND; RoHS: Yes; Category: Chip SMD Resistors; Stock 1: 2773085; Pricing 1: 1=0.10000, 10=0.02400, 100=0.00970, 1000=0.00437, 2500=0.00379 (USD); Mounting Technology: Surface Mount; Case/Package: 0805; Case Code (Metric): 2012; Case Code (Imperial): 0805; Contact Plating: Tin,Matte; Min Operating Temperature: -55°C; Max Operating Temperature: 155°C; Tolerance: 1%; Packaging: Tape and Reel; Resistor Type: Thick Film; Number of Terminations: 2; Max Power Dissipation: 125mW; Features: Automotive AEC-Q200; Series: RMCF; Construction: Rectangular; Length: 2mm; Width: 0.049inch; Height: 0.026inch; Depth: 1.25mm; Radiation Hardening: No; Military Standard: Not; Lead Free: Lead Free; RoHS Compliant: Yes; ComponentLink1URL: https://datasheet.ciiva.com/15193/getdatasheetpartid-360136-15193546.pdf?src-supplier=Verical; ComponentLink1Description: https://datasheet.ciiva.com/15193/getdatasheetpartid-360136-15193546.pdf?src-supplier=Verical
R22 R26 = CMP-1665-00002-5: as R5 on sheet 05_Buzz_Pump_LED_Temp_ICs; REACH SVHC: No SVHC; Min Operating Temperature: -55 degC; Case/Package: 0805; Packaging: Tape and Reel; Package Quantity: 5000; ComponentLink1Description: Manufacturer URL; PackageDescription: 2-Pin Surface Mount Device, Body 2 x 1.25 mm; Mounting Technology: Surface Mount; Max Operating Temperature: 155 degC; PartNumber: ERJ-6GEY0R00V; Width: 1.25 mm; RoHSCompliant: True; Height: 0.6 mm; ComponentLink1URL: http://www.panasonic.com/; ComponentLink2URL: http://industrial.panasonic.com/cdbs/www-data/pdf/RDA0000/AOA0000C84.pdf; Case Code (Imperial): 0805; DatasheetVersion: 03/2015; Length: 2 mm; Case Code (Metric): 2012; ComponentLink2Description: Datasheet; Radiation Hardening: No; Supplier: Newark; Supplier Part Number: 65T8846; Manufacturer Part Number: ERJ-6GEY0R00V; RoHS: Yes; Category: Chip SMD Resistors; Stock: 200593; Pricing: 1=0.008, 25=0.008, 50=0.008, 100=0.008, 250=0.008, 500=0.008, 1000=0.008 (USD); Contact Plating: Tin; Series: ERJ; Termination: SMD/SMT; Resistor Type: Thick Film; Number of Terminations: 2; Technology: THICK FILM; Construction: Rectangular; Max Power Dissipation: 125mW; Voltage Rating (DC): 150V; Features: Automotive AEC-Q200; Depth: 1.25mm; Ratings: AEC-Q200; RoHS Compliant: Yes; Reach SVHC Compliant: No; Military Standard: Not; Lead Free: Lead Free
R23 R27 = CMP-1659-00013-4: as R1 on sheet 05_Buzz_Pump_LED_Temp_ICs; Mount: Surface Mount; ComponentLink1Description: Manufacturer URL; ComponentLink2URL: http://www.yageo.com/documents/recent/PYu-RC_Group_51_RoHS_L_04.pdf; Pins: 2; Length: 2 mm; Min Operating Temperature: -55 degC; Height: 0.5 mm; Mounting Technology: Surface Mount; RoHSCompliant: true; REACH SVHC: No SVHC; ComponentLink1URL: http://www.yageo.com/; Max Operating Temperature: 155 degC; PackageReference: 0805; DatasheetVersion: Rev. 4, 02/2016; Package Quantity: 5000; Packaging: Tape and Reel; ComponentLink2Description: Datasheet; PackageDescription: 2-Pin Surface Mounted Device, Body 2 x 1.25 mm; Supplier 1: Digi-Key; Supplier Part Number 1: 311-10.0KCRCT-ND; Manufacturer 1: Yageo; Manufacturer Part Number 1: RC0805FR-0710KL; RoHS: Yes; Category: Chip SMD Resistors; Stock 1: 5682818; Pricing 1: 1=0.10000, 10=0.03800, 100=0.01560, 1000=0.00702, 2500=0.00610 (USD); Case/Package: 0805; Case Code (Imperial): 0805; Case Code (Metric): 2012; Size Code: 0805; Tolerance: 1%; Resistor Type: Thick Film; Series: RC; Number of Terminations: 2; Max Power Dissipation: 125mW; Termination: SMD/SMT; Features: Moisture Resistant; Construction: Rectangular; Resistance Tolerance: 1%; Technology: THICK FILM; Width: 0.049inch; Depth: 1.25mm; RoHS Compliant: Yes; Military Standard: Not; Lead Free: Lead Free; ComponentLink3URL: https://datasheet.ciiva.com/11808/0900766b8106beab-11808151.pdf?src-supplier=RSComponents; ComponentLink3Description: https://datasheet.ciiva.com/11808/0900766b8106beab-11808151.pdf?src-supplier=RSComponents; ComponentLink4URL: https://datasheet.ciiva.com/46447/444164-46447563.pdf?src-supplier=Element14; ComponentLink4Description: https://datasheet.ciiva.com/46447/444164-46447563.pdf?src-supplier=Element14; ComponentLink5URL: https://datasheet.ciiva.com/2456/pyu-r-int-thick-7-2456973.pdf?src-supplier=Digi-Key; ComponentLink5Description: https://datasheet.ciiva.com/2456/pyu-r-int-thick-7-2456973.pdf?src-supplier=Digi-Key; ComponentLink6URL: https://datasheet.ciiva.com/2456/pyu-r-int-thick-7-2456974.pdf?src-supplier=Digi-Key; ComponentLink6Description: https://datasheet.ciiva.com/2456/pyu-r-int-thick-7-2456974.pdf?src-supplier=Digi-Key; ComponentLink7URL: https://datasheet.ciiva.com/2456/pyu-r-int-thick-7-2456972.pdf?src-supplier=Digi-Key; ComponentLink7Description: https://datasheet.ciiva.com/2456/pyu-r-int-thick-7-2456972.pdf?src-supplier=Digi-Key; ComponentLink8URL: https://datasheet.ciiva.com/12669/rc0805-12669688.pdf?src-supplier=Mouser; ComponentLink8Description: https://datasheet.ciiva.com/12669/rc0805-12669688.pdf?src-supplier=Mouser; ComponentLink9URL: https://datasheet.ciiva.com/16747/rc0805-16747087.pdf?src-supplier=Future+Electronics; ComponentLink9Description: https://datasheet.ciiva.com/16747/rc0805-16747087.pdf?src-supplier=Future+Electronics; Supplier: Newark; Supplier Part Number: 05M4535; Manufacturer Part Number: RC0805FR-0710KL; Stock: 346650; Pricing: 1=0.102, 10=0.035, 25=0.028, 50=0.021, 100=0.014 (USD); Reach SVHC Compliant: Unknown; ComponentLink10URL: https://datasheet.ciiva.com/11808/0900766b8106beab-11808151.pdf?src-supplier=Rs; ComponentLink10Description: https://datasheet.ciiva.com/11808/0900766b8106beab-11808151.pdf?src-supplier=Rs
U4 U5 = DRV8251DDAR: No Description Available; Mfr_Name: Texas Instruments; Copyright: Copyright (C) 2023 Ultra Librarian. All rights reserved.; Manufacturer_Part_Number: DRV8251DDAR; RefDes: RefDes; Type: DEV

## Sheet 03_Power_ICs.SchDoc: Power ICs
size A; Revision: A; SheetNumber: 3; SheetTotal: 10; ECE315_Project_Name: ECE453 F23 Base Project
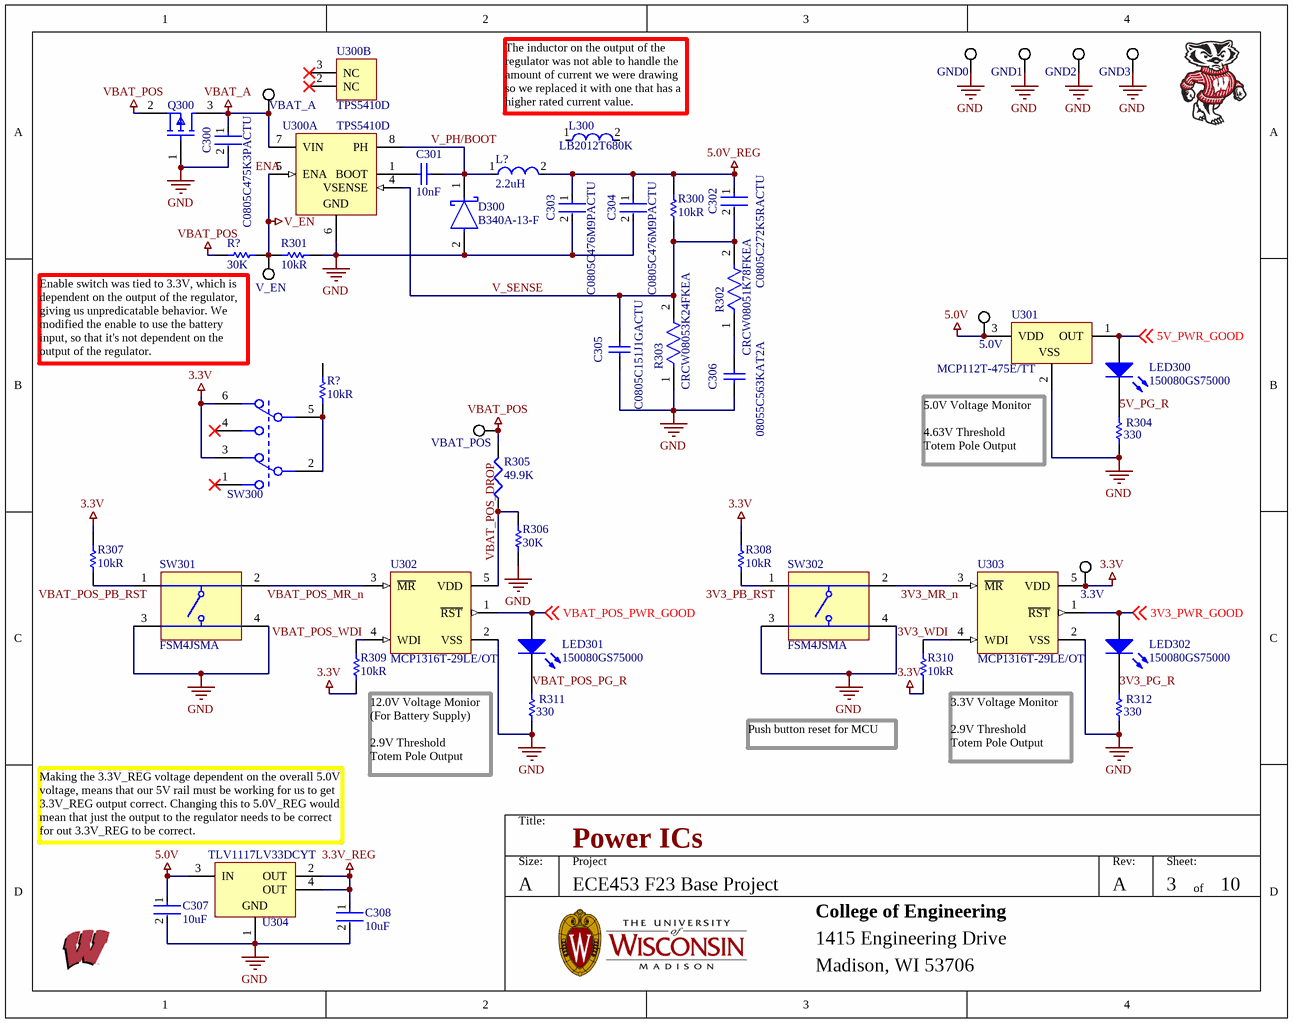
[diagram p3: 03_Power_ICs.SchDoc]

### Parts
(Parts that share a designator on the sheet are numbered #1, #2 ... from top to bottom, then left to right.)
3.3V  5019  [KSTN-5019_V]  (value not drawn)
5.0V  5019  [KSTN-5019_V]  (value not drawn)
C300  C0805C475K3PACTU  [FP-C0805C475K3PACTU-MFG]
C301  10nF  [CAP_0805]
C302  C0805C272K5RACTU  [FP-C0805C-DN-MFG]
C303  C0805C476M9PACTU  [FP-C0805C476M9PACTU-MFG]
C304  C0805C476M9PACTU  [FP-C0805C476M9PACTU-MFG]
C305  C0805C151J1GACTU  [CAPC2013X88X50NL20T25]
C306  08055C563KAT2A  [CAPC2013X94X50NL20T25]
C307  value 10uF  [FP-C0805C-DG-MFG]  (hidden comment: C0805C106K8PACTU)
C308  value 10uF  [FP-C0805C-DG-MFG]  (hidden comment: C0805C106K8PACTU)
D300  B340A-13-F  [FP-SMA-MFG]
GND0  5019  [KSTN-5019_V]  (value not drawn)
GND1  5019  [KSTN-5019_V]  (value not drawn)
GND2  5019  [KSTN-5019_V]  (value not drawn)
GND3  5019  [KSTN-5019_V]  (value not drawn)
L300  LB2012T680K  [FP-LB2012-1_25-0_2-IPC_A]
L?  Inductance: 2.2uH  [IND_TAIYO_NRS4018_TAY]  (hidden comment: NRS4018T2R2MDGJ)
LED300  150080GS75000  [0805_A]
LED301  150080GS75000  [0805_A]
LED302  150080GS75000  [0805_A]
Q300  SSM3J328R,LF  [SOT-23_M]  (value not drawn)
R300  Resistance: 10kR  [RESC2013X60X35NL10T20]  (hidden comment: RC0805FR-0710KL)
R301  Resistance: 10kR  [RESC2013X60X35NL10T20]  (hidden comment: RC0805FR-0710KL)
R302  CRCW08051K78FKEA  [FP-CRCW0805-e3-IPC_C]
R303  CRCW08053K24FKEA  [FP-CRCW0805-e3-IPC_C]
R304  Resistance: 330  [RESC2013X60X35LL10T20]  (hidden comment: RC0805FR-07330RL)
R305  49.9K  [RES_0805]
R306  30K  [RES_0805]
R307  Resistance: 10kR  [RESC2013X60X35NL10T20]  (hidden comment: RC0805FR-0710KL)
R308  Resistance: 10kR  [RESC2013X60X35NL10T20]  (hidden comment: RC0805FR-0710KL)
R309  Resistance: 10kR  [RESC2013X60X35NL10T20]  (hidden comment: RC0805FR-0710KL)
R310  Resistance: 10kR  [RESC2013X60X35NL10T20]  (hidden comment: RC0805FR-0710KL)
R311  Resistance: 330  [RESC2013X60X35LL10T20]  (hidden comment: RC0805FR-07330RL)
R312  Resistance: 330  [RESC2013X60X35LL10T20]  (hidden comment: RC0805FR-07330RL)
R?#1  30K  [RES_0805]
R?#2  Resistance: 10kR  [RESC2013X60X35NL10T20]  (hidden comment: RC0805FR-0710KL)
SW300  JS202011SCQN  [C&K_Components_0_MFG]  (value not drawn)
SW301  FSM4JSMA  [TECO-FSM4JSMA_V]
SW302  FSM4JSMA  [TECO-FSM4JSMA_V]
U300  TPS5410D  [D0008A_N]  (parts A,B of 2)
U301  MCP112T-475E/TT  [SOT-23-TT3_L]
U302  MCP1316T-29LE/OT  [SOT-23-OT5_M]
U303  MCP1316T-29LE/OT  [SOT-23-OT5_M]
U304  TLV1117LV33DCYT  [DCY0004A_M]
V_EN  5019  [KSTN-5019_V]  (value not drawn)
VBAT_A  5019  [KSTN-5019_V]  (value not drawn)
VBAT_POS  5019  [KSTN-5019_V]  (value not drawn)

### Nets
3.3V: 3.3V.1 R307.2 R308.2 R309.1 R310.1 SW300.3 SW300.6 U303.5(VDD)
3.3V_REG: C308.1 U304.2(OUT) U304.4(OUT)
5.0V: 5.0V.1 C307.1 U301.3(VDD) U304.3(IN)
5.0V_REG: C302.1 C303.1 C304.1 L?.2 R300.1
ENA: R301.1 R?#1.2 U300.5(ENA) V_EN.1  [also labelled V_EN]
GND: C300.2 C303.2 C304.2 C305.1 C306.1 C307.2 C308.2 D300.2(A) GND0.1 GND1.1 GND2.1 GND3.1 Q300.1(Gate) R301.2 R303.1 R304.1 R306.1 R311.1 R312.1 SW301.3 SW301.4 SW302.3 SW302.4 U300.6(GND) U301.2(VSS) U302.2(VSS) U303.2(VSS) U304.1(GND)
VBAT_A: C300.1 Q300.3(Drain) U300.7(VIN) VBAT_A.1
VBAT_POS: Q300.2(Source) R305.2 R?#1.1 VBAT_POS.1
3V3_MR_n: SW302.2 U303.3(~{MR})
3V3_PB_RST: R308.1 SW302.1
3V3_PG_R: LED302.1(K) R312.2
3V3_PWR_GOOD: LED302.2(A) U303.1(~{RST}) ; off-sheet 3V3_PWR_GOOD
3V3_WDI: R310.2 U303.4(WDI)
5V_PG_R: LED300.1(K) R304.2
5V_PWR_GOOD: LED300.2(A) U301.1(OUT) ; off-sheet 5V_PWR_GOOD
V_PH/BOOT: C301.2 D300.1(C) L?.1 U300.8(PH)
V_SENSE: C302.2 C305.2 R300.2 R302.2 R303.2 U300.4(VSENSE)
VBAT_POS_DROP: R305.1 R306.2 U302.5(VDD)
VBAT_POS_MR_n: SW301.2 U302.3(~{MR})
VBAT_POS_PB_RST: R307.1 SW301.1
VBAT_POS_PG_R: LED301.1(K) R311.2
VBAT_POS_PWR_GOOD: LED301.2(A) U302.1(~{RST}) ; off-sheet VBAT_POS_PWR_GOOD
VBAT_POS_WDI: R309.2 U302.4(WDI)
NetC301_1: C301.1 U300.1(BOOT)
NetC306_2: C306.2 R302.1
NetR?#2_1: R?#2.1 SW300.2 SW300.5

Not connected (* = marked no-connect by the designer): L300 1 2; R?#2 2; SW300 1* 4*; U300 2(NC)* 3(NC)*

### Notes on the sheet
- (near L300) The inductor on the output of the regulator was not able to handle the amount of current we were drawing so we replaced it with one that has a higher rated current value.
- Enable switch was tied to 3.3V, which is dependent on the output of the regulator, giving us unpredicatable behavior. We modified the enable to use the battery input, so that it's not dependent on the output of the regulator.
- (near U301) 5.0V Voltage Monitor
  4.63V Threshold
  Totem Pole Output
- (near R309) 12.0V Voltage Monior (For Battery Supply)
  2.9V Threshold
  Totem Pole Output
- (near R310) Push button reset for MCU
- 3.3V Voltage Monitor
  2.9V Threshold
  Totem Pole Output
- (near U304) Making the 3.3V_REG voltage dependent on the overall 5.0V voltage, means that our 5V rail must be working for us to get 3.3V_REG output correct. Changing this to 5.0V_REG would mean that just the output to the regulator needs to be correct for out 3.3V_REG to be correct.
- Title:
- Size:
- A
- Project
- Rev:
- Sheet:
- of
- College of Engineering
- 1415 Engineering Drive
- Madison, WI 53706